# Altium project ph-meter.PrjPcb
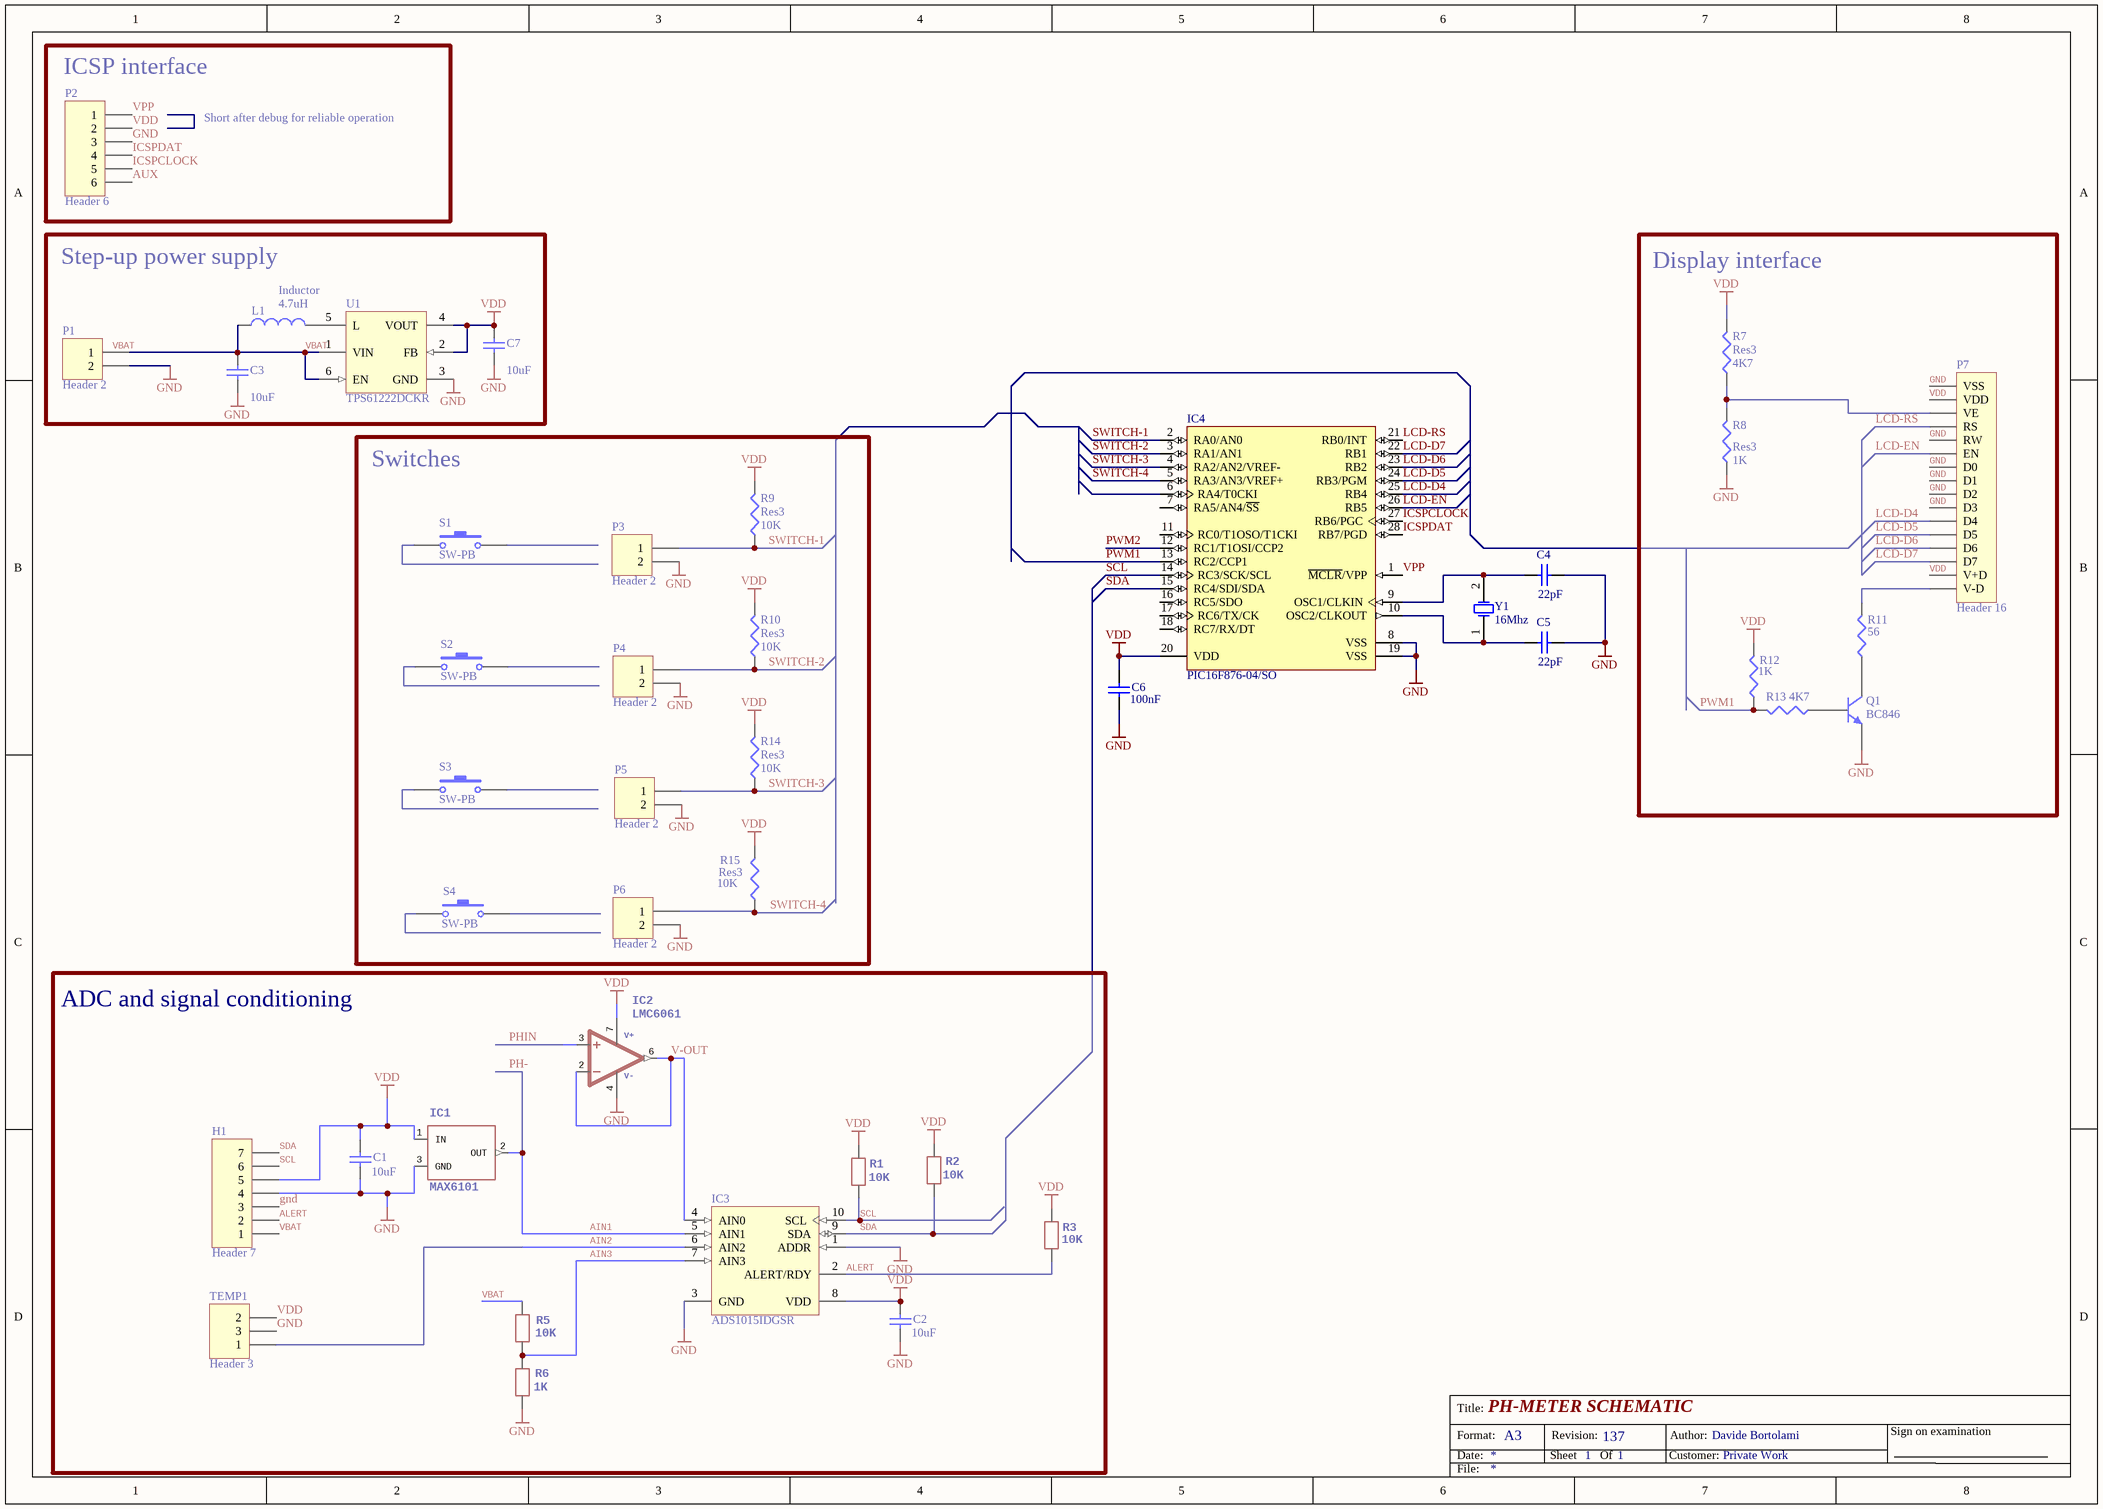
[diagram p0: Main_Board.SchDoc]
1 sheet, 42 parts. Net scope: global (net labels, ports and power ports of the same name join across sheets).
Board file: Analog_Board_pcb.PcbDoc

## Sheet Main_Board.SchDoc: PH-METER SCHEMATIC
size A3; Author: Davide Bortolami; CompanyName: Private Work; Revision: 137; SheetNumber: 1; SheetTotal: 1

### Parts
C1  value 10uF  [C1206]
C2  value 10uF  [C1206]
C3  value 10uF  [C1206]
C4  value 22pF  [C1206]
C5  value 22pF  [C1206]
C6  value 100nF  [C1206]  (hidden comment: CAP)
C7  value 10uF  [C1206]
H1  Header 7  [HDR1X7]
IC1  MAX6101  [SOT23]
IC2  LMC6061  [SO08]
IC3  ADS1015IDGSR  [TI-DGS10_N]
IC4  PIC16F876-04/SO  [MCHP-SOIC-SO28_L]
L1  Inductor  value 4.7uH  [INDC4532]
P1  Header 2  [HDR1X2]
P2  Header 6  [HDR1X6]
P3  Header 2  [HDR1X2]
P4  Header 2  [HDR1X2]
P5  Header 2  [HDR1X2]
P6  Header 2  [HDR1X2]
P7  Header 16  [HDR1X16]
Q1  BC846  [SOT23_L]
R1  10K  [6-0805_M]
R2  10K  [6-0805_M]
R3  10K  [6-0805_M]
R5  10K  [6-0805_M]
R6  1K  [6-0805_M]
R7  Res3  value 4K7  [6-0805_M]
R8  Res3  value 1K  [6-0805_M]
R9  Res3  value 10K  [6-0805_M]
R10  Res3  value 10K  [6-0805_M]
R11  value 56  [6-0805_M]  (hidden comment: Res3)
R12  value 1K  [6-0805_M]  (hidden comment: Res3)
R13  value 4K7  [6-0805_M]  (hidden comment: Res3)
R14  Res3  value 10K  [6-0805_M]
R15  Res3  value 10K  [6-0805_M]
S1  SW-PB
S2  SW-PB
S3  SW-PB
S4  SW-PB
TEMP1  Header 3  [HDR1X3]
U1  TPS61222DCKR  [DCK6_N]
Y1  16Mhz  [CFPX-93]

### Blocks framed on the sheet
ICSP interface: P2
Step-up power supply: C3 C7 L1 P1 U1
Display interface: P7 Q1 R7 R8 R11-R13
Switches: P3-P6 R9 R10 R14 R15 S1-S4
ADC and signal conditioning: C1 C2 H1 IC1-IC3 R1-R3 R5 R6 TEMP1

### Nets
GND: C1.1 C2.1 C3.1 C4.2 C5.2 C6.1 C7.1 H1.3 H1.4 IC1.3(GND) IC2.4(V-) IC3.1(ADDR) IC3.3(GND) IC4.8(VSS) IC4.19(VSS) P1.2 P2.3 P3.2 P4.2 P5.2 P6.2 P7.1(VSS) P7.5(RW) P7.7(D0) P7.8(D1) P7.9(D2) P7.10(D3) Q1.2(E) R6.2 R8.1 TEMP1.3 U1.3(GND)
VDD: C1.2 C2.2 C6.2 C7.2 H1.5 IC1.1(IN) IC2.7(V+) IC3.8(VDD) IC4.20(VDD) P2.2 P7.2(VDD) P7.15(V+D) R1.1 R2.1 R3.1 R7.2 R9.2 R10.2 R12.2 R14.2 R15.2 TEMP1.2 U1.2(FB) U1.4(VOUT)
AIN1: IC1.2(OUT) IC3.5(AIN1)  [also labelled PH-]
AIN2: IC3.6(AIN2) TEMP1.1
AIN3: IC3.7(AIN3) R5.2 R6.1
ALERT: H1.2 IC3.2(ALERT/RDY) R3.2
AUX: P2.6
ICSPCLOCK: IC4.27(RB6/PGC) P2.5
ICSPDAT: IC4.28(RB7/PGD) P2.4
LCD-D4: IC4.25(RB4) P7.11(D4)
LCD-D5: IC4.24(RB3/PGM) P7.12(D5)
LCD-D6: IC4.23(RB2) P7.13(D6)
LCD-D7: IC4.22(RB1) P7.14(D7)
LCD-EN: IC4.26(RB5) P7.6(EN)
LCD-RS: IC4.21(RB0/INT) P7.4(RS)
PHIN: IC2.3(+IN)
PWM1: IC4.13(RC2/CCP1) R12.1 R13.2
PWM2: IC4.12(RC1/T1OSI/CCP2)
SCL: H1.6 IC3.10(SCL) IC4.14(RC3/SCK/SCL) R1.2
SDA: H1.7 IC3.9(SDA) IC4.15(RC4/SDI/SDA) R2.2
SWITCH-1: IC4.2(RA0/AN0) P3.1 R9.1
SWITCH-2: IC4.3(RA1/AN1) P4.1 R10.1
SWITCH-3: IC4.4(RA2/AN2/VREF-) P5.1 R14.1
SWITCH-4: IC4.5(RA3/AN3/VREF+) P6.1 R15.1
V-OUT: IC2.2(-IN) IC2.6(OUT) IC3.4(AIN0)
VBAT: C3.2 H1.1 L1.1 P1.1 R5.1 U1.1(VIN) U1.6(EN)
VPP: IC4.1(~{MCLR}/VPP) P2.1
NetC4_1: C4.1 IC4.9(OSC1/CLKIN) Y1.2(OSC2)
NetC5_1: C5.1 IC4.10(OSC2/CLKOUT) Y1.1(OSC1)
NetL1_2: L1.2 U1.5(L)
NetP7_3: P7.3(VE) R7.1 R8.2
NetP7_16: P7.16(V-D) R11.2
NetQ1_1: Q1.1(B) R13.1
NetQ1_3: Q1.3(C) R11.1

Not connected (* = marked no-connect by the designer): IC4 6(RA4/T0CKI) 7(RA5/AN4/~{SS}) 11(RC0/T1OSO/T1CKI) 16(RC5/SDO) 17(RC6/TX/CK) 18(RC7/RX/DT); S1 1 2; S2 1 2; S3 1 2; S4 1 2

### Notes on the sheet
- Short after debug for reliable operation
- Labels drawn without touching a wire or pin: VBAT
- Title:
- Format:
- Date:
- A3
- Sheet
- Revision:
- Of
- Customer:
- Author:
- Sign on examination
- File:

### Library data of the parts
C1-C7 = Cap Semi: Capacitor (Semiconductor SIM Model); Published: 8-Jun-2000; LatestRevisionDate: 29-May-2009; LatestRevisionNote: IPC-7351 Footprint Added.; PackageReference: C1206; Publisher: Altium Limited; PackageDescription: Chip Capacitor
H1 = Header 7: Header, 7-Pin; LatestRevisionDate: 17-Jul-2002; LatestRevisionNote: Re-released for DXP Platform.; Publisher: Altium Limited
IC1 = MAX6520: <b> 1.2V Voltage Reference</b> 50ppm/°C, SOT23, 3-Terminal<p> / Source: <a href="http://datasheets.maxim-ic.com/en/ds/MAX6520.pdf"> Data sheet </a>; MPN: MAX6520EUR-T; MF: MAXIM; OC_FARNELL: unknown; OC_NEWARK: 02J4586
IC2 = 1AMP_P7+4D: <b>OP AMP</b>; V+: V+; V-: V-
IC3 = ADS1015IDGSR: 12-Bit ADC with Integrated Multiplexer, PGA, Comparator, Oscillator, and Reference, -40 to 125 degC, 10-pin SOP (DGS10), Green (RoHS & no Sb/Br); Manufacturer: Texas Instruments; # Input Channels: 4; Analog Voltage AV/DD(Max)(V): 5.5; Analog Voltage AV/DD(Min)(V): 2; Architecture: Delta-Sigma; INL(Max)(+/-LSB): 0.5; Interface: Serial I2C; Resolution(Bits): 12; Sample Rate (max)(SPS): 3.3k; SubFamily: Precision ADC (<=10MSPS); DatasheetVersion: SBAS473C; PackageVersion: 4073272/C, 02/2004; PackageReference: DGS10; PackageDescription: 10-Pin Plastic Small Outline, Body 3 x 3 mm, Pitch 0.5 mm; Supplier 1: Digi-Key; Supplier Part Number 1: ADS1251U/2K5G4-ND; Supplier 2: Mouser; Supplier Part Number 2: 595-ADS1251U/2K5G4; Digital Supply(Max)(V): 5.5; Digital Supply(Min)(V): 2; Eco-Plan: Green (RoHS & no Sb/Br); Mounting Technology: Surface Mount; Code_JEDEC: MO-153; PartNumber: ADS1015IDGSR; ComponentLink1Description: Manufacturer URL; ComponentLink1URL: http://www.ti.com/; ComponentLink2Description: Datasheet; ComponentLink2URL: http://www.ti.com/general/docs/lit/getliterature.tsp?genericPartNumber=ADS1015&fileType=pdf; ComponentLink3Description: Package Specification; ComponentLink3URL: http://www.ti.com/lit/ml/mpds035b/mpds035b.pdf
IC4 = PIC16F876-04/SO: 8-Bit CMOS Flash Microcontroller, 4 MHz, 22 I/O, 0 to 70 degC, 28-pin SOIC (SO28), Tube; Manufacturer: Microchip; # of A/D Channels: 5; Digital Communication: 0 -UART, 1 -A/E/USART, 0 -SPI, 0 -I2C, 1 -MSSP(SPI/I2C); EEPROM Data Memory (bytes): 256; I/O Pins: 22; Max. CPU Speed MHz: 4; Operation Voltage Range: 4V - 5.5V; Program Memory KBytes: 14; Program Memory KWords: 8; RAM: 368; Timers: 2 - 8-bit, 1 - 16-bit; DatasheetVersion: Rev. D; PackageVersion: C04-052C, 12/2012; PackageReference: SOIC-SO28; PackageDescription: 28-Lead Plastic Small Outline, 17.9 x 7.5 mm Body, 1.27 mm Pitch; Supplier 1: Digi-Key; Supplier Part Number 1: PIC16F876-04/SO-ND; Supplier 2: Farnell; Supplier Part Number 2: 9761225MPKG; Supplier 3: Farnell; Supplier Part Number 3: 9761225; Supplier 4: Farnell; Supplier Part Number 4: 1660037; Supplier 5: Newark; Supplier Part Number 5: 23C5082; Supplier 6: Mouser; Supplier Part Number 6: 579-PIC16F876-04/SO; Memory Type: Flash; Packing: TUBE; RoHS: TRUE; Mounting Technology: Surface Mount; PartNumber: PIC16F876-04/SO; ComponentLink1Description: Datasheet; ComponentLink1URL: http://ww1.microchip.com/downloads/en/DeviceDoc/30292D.pdf; ComponentLink2Description: Package Specification; ComponentLink2URL: http://www.microchip.com/stellent/groups/techpub_sg/documents/packagingspec/en012702.pdf; ComponentLink3Description: URL Link1; ComponentLink3URL: Product URL:http://www.microchip.com/datasheet/PIC16F876
L1 = Inductor: Code_IEC: 1005; Published: 8-Jun-2000; LatestRevisionDate: 29-May-2009; LatestRevisionNote: IPC-7351 Footprint Added.; PackageReference: 0402-A; Publisher: Altium Limited; PackageDescription: Chip Inductor; Code_JEITA: 0402
P1 P3-P6 = Header 2: Header, 2-Pin; LatestRevisionDate: 17-Jul-2002; LatestRevisionNote: Re-released for DXP Platform.; Publisher: Altium Limited
P2 = Header 6: Header, 6-Pin; LatestRevisionDate: 17-Jul-2002; LatestRevisionNote: Re-released for DXP Platform.; Publisher: Altium Limited
P7 = Header 16: Header, 16-Pin; LatestRevisionDate: 17-Jul-2002; LatestRevisionNote: Re-released for DXP Platform.; Publisher: Altium Limited
Q1 = BC846: NPN General-purpose Transistor; Published: 17-Sep-2003; LatestRevisionDate: 12-Dec-2006; LatestRevisionNote: IPC-7351 Footprint Added.; DatasheetVersion: 4-Feb-2002; PackageVersion: May-1999; PackageReference: SOT23; Publisher: Altium Limited; PackageDescription: 3-Pin SOT-23 Package 0.95 mm Pitch, 2.3 mm Lead Span; ComponentLink1Description: Manufacturer Link; ComponentLink1URL: http://www.semiconductors.philips.com/; ComponentLink2Description: Datasheet; ComponentLink2URL: http://www.semiconductors.philips.com/acrobat/datasheets/BC846_BC847_BC848_5.pdf
R1-R3 R5 R6 = RESISTOR0805: <p><b>Resistors</b></p> / <b>0402</b> - 0402 Surface Mount Package / <ul> / <li>22 Ohm 1% 1/16W [Digikey: 311-22.0LRTR-ND]</li> / <li>33 Ohm 5% 1/16W</li> / <li>1.0K 5% 1/16W</li> / <li>1.5K 5% 1/16W</li> / <li>2.0K 1% 1/16W</li> / <li>10.0K 1% 1/16W [Digikey: 311-10.0KLRTR-ND]</li> / <li>10.0K 5% 1/16W [Digikey: RMCF0402JT10K0TR-ND]</li> / <li>12.1K 1% 1/16W [Digikey: 311-22.0LRTR-ND]</li> / <li>100.0K 5% 1/16W</li> / </ul> / <b>0603</b> - 0603 Surface Mount Package<br> / <ul> / <li>0 Ohm 1/10 Watt 1% Resistor</li> / <li>15 Ohm 1/10 Watt 1% Resistor</li> / <li>33 Ohm 1/10 Watt 1% Resistor</li> / <li>49.9 Ohm 1/10 Watt 1% Resistor</li> / <li>100 Ohm 1/10 Watt 1% Resistor</li> / <li>150 Ohm 1/10 Watt 1% Resistor</li> / <li>240 Ohm 1/10 Watt 1% Resistor</li> / <li>390 Ohm 1/10 Watt 1% Resistor</li> / <li>560 Ohm 1/10 Watt 1% Resistor</li> / <li>680 Ohm 1/10 Watt 1% Resistor</li> / <li>750 Ohm 1/10 Watt 1% Resistor</li> / <li>1.0K Ohm 1/10 Watt 1% Resistor</li> / <li>1.5K Ohm 1/10 Watt 1% Resistor</li> / <li>2.0K Ohm 1/10 Watt 1% Resistor</li> / <li>2.2K Ohm 1/10 Watt 1% Resistor</li> / <li>3.3K Ohm 1/10 Watt 1% Resistor</li> / <li>4.7K Ohm 1/10 Watt 1% Resistor</li> / <li>10.0K Ohm 1/10 Watt 1% Resistor</li> / <li>12.0K Ohm 1/10 Watt 1% Resistor</li> / <li>12.1K Ohm 1/10 Watt 1% Resistor</li> / <li>20.0K Ohm 1/10 Watt 1% Resistor</li> / <li>33.0K Ohm 1/10 Watt 1% Resistor</li> / <li>100.0K Ohm 1/10 Watt 1% Resistor</li> / </ul> / <b>0805</b> - 0805 Surface Mount Package / <ul> / <li>0 Ohm 1/8 Watt 1% Resistor</li> / <li>33 Ohm 1/8 Watt 1% Resistor</li> / <li>100 Ohm 1/8 Watt 1% Resistor</li> / <li>150 Ohm 1/8 Watt 1% Resistor</li> / <li>200 Ohm 1/8 Watt 1% Resistor</li> / <li>240 Ohm 1/8 Watt 1% Resistor</li> / <li>330 Ohm 1/8 Watt 1% Resistor</li> / <li>390 Ohm 1/8 Watt 1% Resistor</li> / <li>470 Ohm 1/8 Watt 1% Resistor</li> / <li>1.0K Ohm 1/8 Watt 1% Resistor</li> / <li>1.5K Ohm 1/8 Watt 1% Resistor</li> / <li>2.0K Ohm 1/8 Watt 1% Resistor</li> / <li>4.7K Ohm 1/8 Watt 1% Resistor</li> / <li>5.1K Ohm 1/8 Watt 1% Resistor</li> / <li>5.6K Ohm 1/8 Watt 1% Resistor</li> / <li>10.0K Ohm 1/8 Watt 1% Resistor</li> / <li>22.0K Ohm 1/8 Watt 1% Resistor</li> / <li>33.0K Ohm 1/8 Watt 1% Resistor</li> / <li>100K Ohm 1/8 Watt 1% Resistor</li> / </ul> / <b>1206</b> - 1206 Surface Mount Package<br/> / <br/> / <b>2012</b> - 2010 Surface Mount Package<br/> / <ul><li>0.11 Ohm 1/2 Watt 1% Resistor - Digikey: RHM.11UCT-ND</li></ul>
R7-R15 = Res3: Resistor; Published: 8-Jun-2000; LatestRevisionDate: 29-May-2009; LatestRevisionNote: IPC-7351 Footprint Added.; PackageReference: J1-0603; Publisher: Altium Limited; PackageDescription: Chip Resistor
S1-S4 = SW-PB: Switch; Published: 24-Mar-1999; LatestRevisionDate: 17-Jul-2002; LatestRevisionNote: Re-released for DXP Platform.; PackageReference: SPST-2; Publisher: Altium Limited; PackageDescription: Switch; 2 Leads
TEMP1 = Header 3: Header, 3-Pin; LatestRevisionDate: 17-Jul-2002; LatestRevisionNote: Re-released for DXP Platform.; Publisher: Altium Limited
U1 = TPS61222DCKR: Boost Voltage Converter with 0.7 to 5.5 V Input and 5 V Output, -40 to 85 degC, 6-Pin SC70 (DCK), Green (RoHS & no Sb/Br); Manufacturer: Texas Instruments; Regulated Outputs(#): 1; SubFamily: Step-Up Regulator; Switching Frequency(Max)(kHz): 2000; Vin(Max)(V): 5.5; Vin(Min)(V): 0.7; Vout(Max)(V): 5; DatasheetVersion: SLVS776; PackageVersion: revG, Jan-2007; PackageReference: DCK6; PackageDescription: 6-Pin Plastic Small-Outline Package, 2 x 1.3 mm Body, 0.65 mm Pitch, 2.1 mm Lead Span; Supplier 1: Digi-Key; Supplier Part Number 1: TPS61222DCKR-ND; Supplier 2: Newark; Supplier Part Number 2: 09R6667; Supplier 3: Mouser; Supplier Part Number 3: 595-TPS61222DCKR; Eco-Plan: Green (RoHS & no Sb/Br); Topology: Boost; Vout(Min)(V): 5; Mounting Technology: Surface Mount; Code_JEDEC: MO-203-AB; PartNumber: TPS61222DCKR; ComponentLink1Description: Datasheet; ComponentLink1URL: http://www.ti.com/general/docs/lit/getliterature.tsp?genericPartNumber=TPS61222&fileType=pdf; ComponentLink2Description: Package Specification; ComponentLink2URL: http://www.ti.com/litv/pdf/mpds114c
Y1 = 3SMXA: Surface Mount Quartz Crystal; Note: PCB layout complies with manufacturer's recommendation.; Published: 17-Jul-2002; DatasheetDocument: 6-Apr-1998; PackageDocument: 6-Apr-1998; PackageReference: 3SMXA; Publisher: Altium Limited; ComponentLink1Description: Manufacturer Link; ComponentLink1URL: http://www.cmac.com/mt/; ComponentLink2Description: Datasheet; ComponentLink2URL: http://www.cmac.com/mt/databook/crystals/smd/3smx.pdf